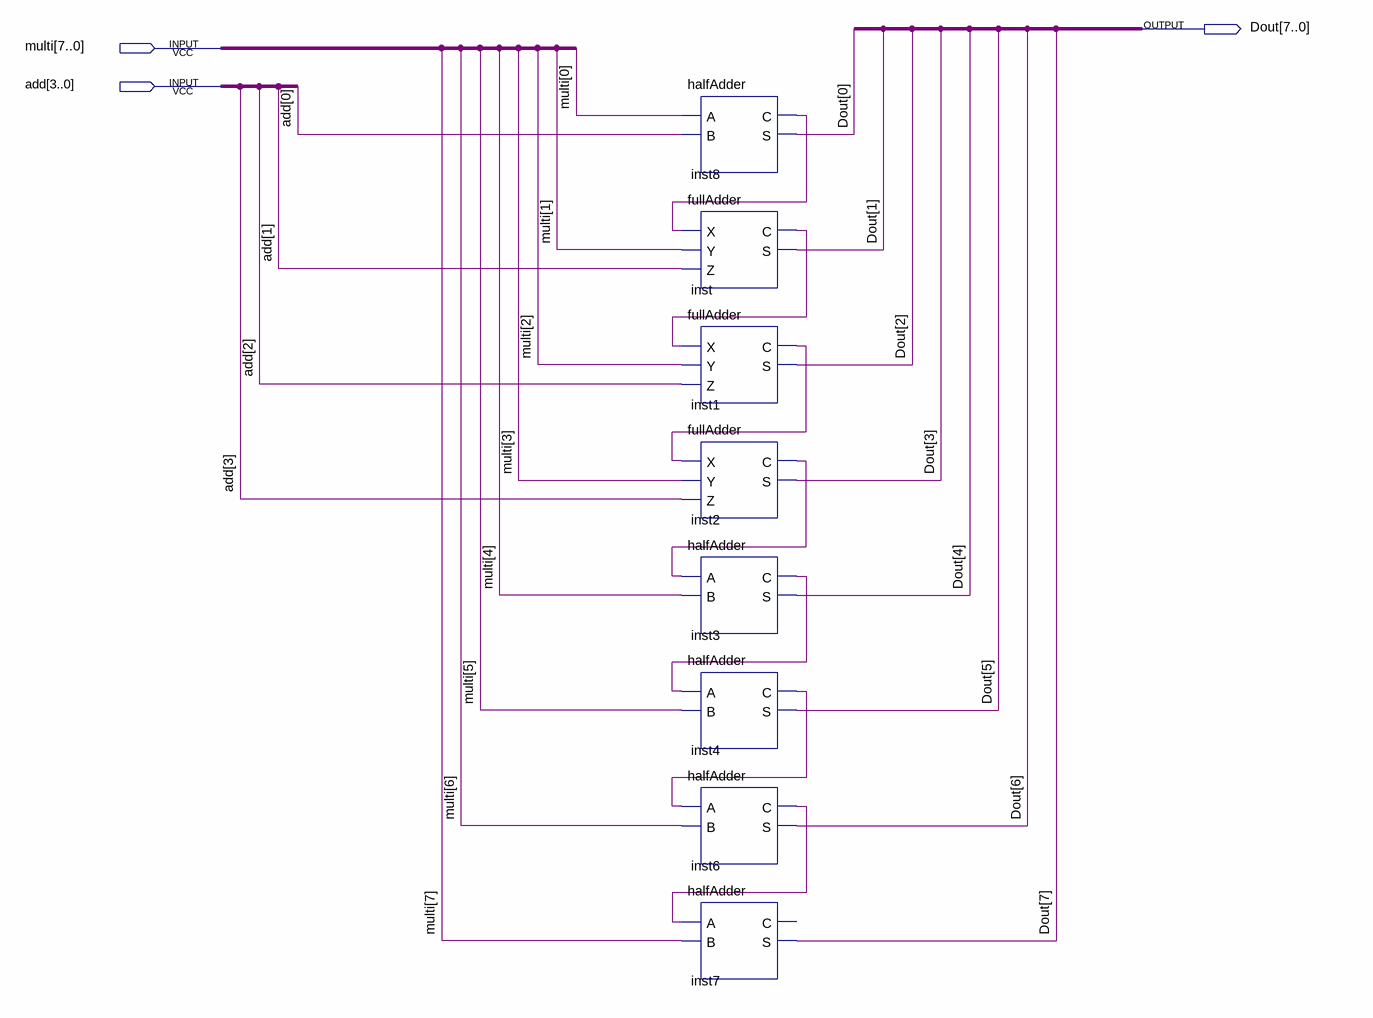
[diagram p0: schematic sheet]
// Quartus schematic addFourEight.bdf as structural Verilog: 8 symbols, 3 pins
module addFourEight (
  input  [7:0] multi,
  input  [3:0] add,
  output [7:0] Dout
);

  wire inst1_c, inst2_c, inst3_c, inst4_c, inst6_c, inst8_c, inst_c;

  halfAdder inst8 (.A(multi[0]), .B(add[0]), .C(inst8_c), .S(Dout[0]));
  fullAdder inst (.X(inst8_c), .Y(multi[1]), .Z(add[1]), .C(inst_c), .S(Dout[1]));
  fullAdder inst1 (.X(inst_c), .Y(multi[2]), .Z(add[2]), .C(inst1_c), .S(Dout[2]));
  fullAdder inst2 (.X(inst1_c), .Y(multi[3]), .Z(add[3]), .C(inst2_c), .S(Dout[3]));
  halfAdder inst3 (.A(inst2_c), .B(multi[4]), .C(inst3_c), .S(Dout[4]));
  halfAdder inst4 (.A(inst3_c), .B(multi[5]), .C(inst4_c), .S(Dout[5]));
  halfAdder inst6 (.A(inst4_c), .B(multi[6]), .C(inst6_c), .S(Dout[6]));
  halfAdder inst7 (.A(inst6_c), .B(multi[7]), .S(Dout[7]));  // open: C
endmodule
